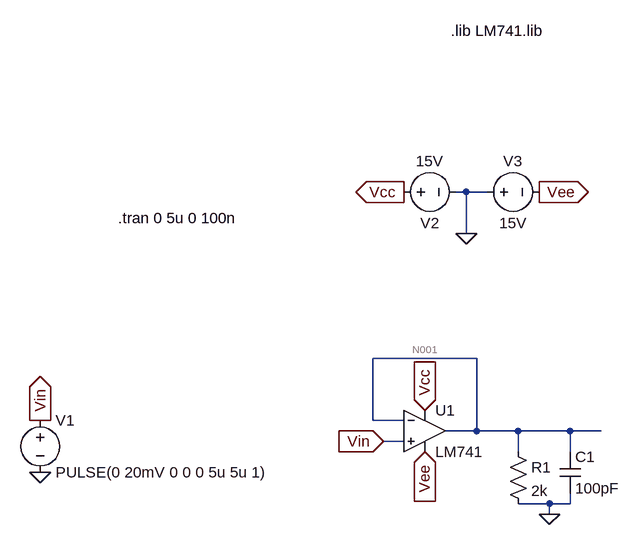
[diagram p0: schematic op_amp_max_swing.asc]
op_amp_max_swing.asc, the LTspice schematic file:
Version 4.1
SHEET 1 880 680
WIRE 240 -208 224 -208
WIRE 272 -208 240 -208
WIRE 240 -144 240 -208
WIRE 256 48 96 48
WIRE 96 144 96 48
WIRE 144 144 96 144
WIRE 256 160 256 48
WIRE 256 160 208 160
WIRE 320 160 256 160
WIRE 400 160 320 160
WIRE 448 160 400 160
WIRE 144 176 112 176
WIRE 320 192 320 160
WIRE 400 192 400 160
WIRE 368 272 320 272
WIRE 400 272 400 256
WIRE 400 272 368 272
WIRE 368 288 368 272
FLAG -416 224 0
FLAG 144 -208 Vcc
IOPIN 144 -208 Out
FLAG 352 -208 Vee
IOPIN 352 -208 Out
FLAG 240 -144 0
FLAG -416 144 Vin
IOPIN -416 144 Out
FLAG 176 128 Vcc
IOPIN 176 128 In
FLAG 176 192 Vee
IOPIN 176 192 In
FLAG 112 176 Vin
IOPIN 112 176 In
FLAG 368 288 0
SYMBOL voltage -416 128 R0
WINDOW 123 0 0 Left 0
WINDOW 39 0 0 Left 0
SYMATTR InstName V1
SYMATTR Value PULSE(0 20mV 0 0 0 5u 5u 1)
SYMBOL voltage 128 -208 R270
WINDOW 0 -32 56 VBottom 2
WINDOW 3 32 56 VTop 2
WINDOW 123 0 0 Left 0
WINDOW 39 0 0 Left 0
SYMATTR InstName V2
SYMATTR Value 15V
SYMBOL voltage 256 -208 R270
WINDOW 0 32 56 VTop 2
WINDOW 3 -32 56 VBottom 2
WINDOW 123 0 0 Left 0
WINDOW 39 0 0 Left 0
SYMATTR InstName V3
SYMATTR Value 15V
SYMBOL OpAmps\\opamp2 176 96 R0
SYMATTR InstName U1
SYMATTR Value LM741
SYMBOL res 304 176 R0
SYMATTR InstName R1
SYMATTR Value 2k
SYMBOL cap 384 192 R0
SYMATTR InstName C1
SYMATTR Value 100pF
TEXT -296 -168 Left 2 !.tran 0 5u 0 100n
TEXT 216 -456 Left 2 !.lib LM741.lib

The netlist it stands for:
* op_amp_max_swing.asc
V1 Vin 0 PULSE(0 20mV 0 0 0 5u 5u 1)
V2 Vcc 0 15V
V3 0 Vee 15V
X§U1 Vin N001 Vcc Vee N001 LM741  ; pins In+ In- V+ V- OUT
R1 N001 0 2k
C1 N001 0 100pF
.tran 0 5u 0 100n
.lib LM741.lib
.backanno
.end

* Results of the author's LTspice run, read from the files saved beside the schematic
* Operating Point, zero values left out:
*   V(vcc) = 15 V
*   V(n001) = 1 mV
*   V(vee) = -15 V
*   I(V1) = -57.86 nA
*   I(V3) = -1.701 mA
*   I(R1) = 500 nA
*   I(V2) = -1.701 mA
*   Ix(u1:1) = 57.86 nA
*   Ix(u1:2) = 101.9 nA
*   Ix(u1:99) = 1.701 mA
*   Ix(u1:50) = -1.701 mA
*   Ix(u1:28) = -601.9 nA